# EAGLE design water-pump (EAGLE 8.7.1)
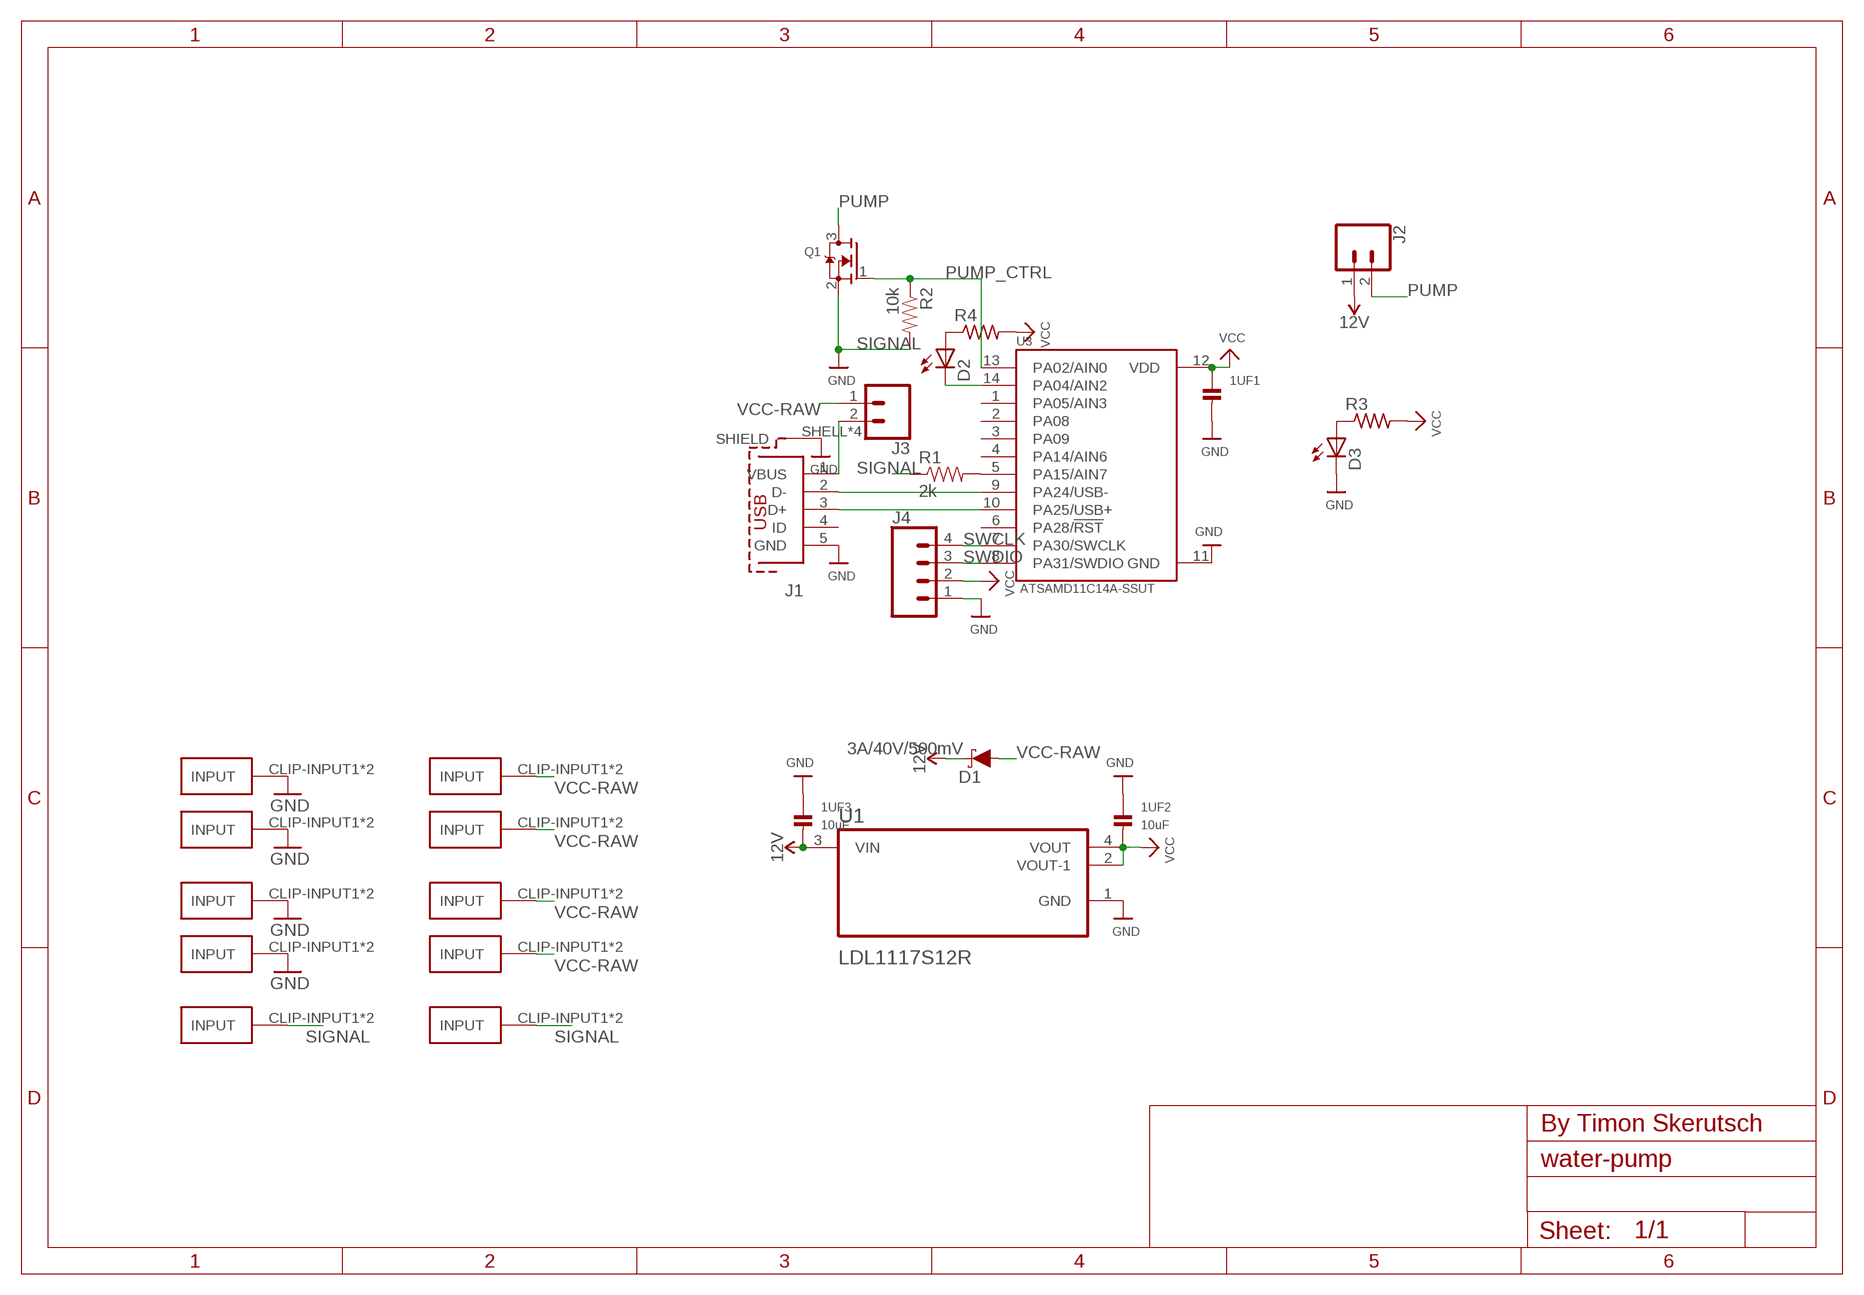
[diagram p0: schematic, sheet 1]

## Parts
1UF1  CAP_CERAMIC0603  [0603]
1UF2  10uF  CAP_CERAMIC0805  [0805]
1UF3  10uF  CAP_CERAMIC0805  [0805]
D1  3A/40V/500mV  DIODE-SCHOTTKY-B340A  [SMA-DIODE]
D2  LEDCHIPLED_0805  [CHIPLED_0805]
D3  LEDCHIPLED_0805  [CHIPLED_0805]
GND-CLIP  FUSE-HOLDER-5X20MM  [FUSE-HOLDER-5X20MM]
GND-CLIP1  FUSE-HOLDER-5X20MM  [FUSE-HOLDER-5X20MM]
GND-CLIP2  FUSE-HOLDER-5X20MM  [FUSE-HOLDER-5X20MM]
GND-CLIP3  FUSE-HOLDER-5X20MM  [FUSE-HOLDER-5X20MM]
J1  629105136821  [629105136821]
J2  CONN_02PTH3  [1X02_LONGPADS]
J3  CONN_02PTH3  [1X02_LONGPADS]
J4  CONN_04  [1X04]
PWM-CLIP  FUSE-HOLDER-5X20MM  [FUSE-HOLDER-5X20MM]
PWM-CLIP1  FUSE-HOLDER-5X20MM  [FUSE-HOLDER-5X20MM]
Q1  MOSFET-NWIDE  [SOT23-WIDE]
R1  2k  RESISTOR1206  [1206]
R2  10k  RESISTOR1206  [1206]
R3  R-US_R0805  [R0805]
R4  R-US_R0805  [R0805]
U1  LDL1117S12R  [SOT230P700X180-4N]
U3  ATSAMD11C14A-SSUT  [SOIC127P600X160-14N]
VCC-CLIP  FUSE-HOLDER-5X20MM  [FUSE-HOLDER-5X20MM]
VCC-CLIP1  FUSE-HOLDER-5X20MM  [FUSE-HOLDER-5X20MM]
VCC-CLIP2  FUSE-HOLDER-5X20MM  [FUSE-HOLDER-5X20MM]
VCC-CLIP3  FUSE-HOLDER-5X20MM  [FUSE-HOLDER-5X20MM]

## Nets
12V [VCC]: 1UF3.2 D1.C J2.1 U1.3(VIN)
GND: 1UF1.2 1UF2.1 1UF3.1 D3.C GND-CLIP1.CLIP-INPUT1(INPUT) GND-CLIP1.CLIP-INPUT2(INPUT) GND-CLIP2.CLIP-INPUT1(INPUT) GND-CLIP2.CLIP-INPUT2(INPUT) GND-CLIP3.CLIP-INPUT1(INPUT) GND-CLIP3.CLIP-INPUT2(INPUT) GND-CLIP.CLIP-INPUT1(INPUT) GND-CLIP.CLIP-INPUT2(INPUT) J1.5(GND) J1.SHELL1(SHIELD) J1.SHELL2(SHIELD) J1.SHELL3(SHIELD) J1.SHELL(SHIELD) J4.1 Q1.2(S) R2.2 U1.1(GND) U3.11(GND)
N$1: D3.A R3.1
N$3: R1.2 U3.5(PA15/AIN7)
N$4: J1.3(D+) U3.10(PA25/USB+)
N$5: J1.2(D-) U3.9(PA24/USB-)
N$6: J1.1(VBUS) J3.2
N$7: D2.A R4.1
N$8: D2.C U3.14(PA04/AIN2)
PUMP: J2.2 Q1.3(D)
PUMP_CTRL: Q1.1(G) R2.1 U3.13(PA02/AIN0)
SIGNAL: PWM-CLIP1.CLIP-INPUT1(INPUT) PWM-CLIP1.CLIP-INPUT2(INPUT) PWM-CLIP.CLIP-INPUT1(INPUT) PWM-CLIP.CLIP-INPUT2(INPUT) R1.1
SWCLK: J4.4 U3.7(PA30/SWCLK)
SWDIO: J4.3 U3.8(PA31/SWDIO)
VCC [VCC]: 1UF1.1 1UF2.2 J4.2 R3.2 R4.2 U1.2(VOUT-1) U1.4(VOUT) U3.12(VDD)
VCC-RAW [VCC]: D1.A J3.1 VCC-CLIP1.CLIP-INPUT1(INPUT) VCC-CLIP1.CLIP-INPUT2(INPUT) VCC-CLIP2.CLIP-INPUT1(INPUT) VCC-CLIP2.CLIP-INPUT2(INPUT) VCC-CLIP3.CLIP-INPUT1(INPUT) VCC-CLIP3.CLIP-INPUT2(INPUT) VCC-CLIP.CLIP-INPUT1(INPUT) VCC-CLIP.CLIP-INPUT2(INPUT)
Unconnected: J1.4(ID) U3.1(PA05/AIN3) U3.2(PA08) U3.3(PA09) U3.4(PA14/AIN6) U3.6(PA28/!RST)

## Notes on the sheet
- By Timon Skerutsch

## Library data of the parts
1UF1-1UF3 = microbuilder:CAP_CERAMIC: Ceramic Capacitors 0402 - 0402 Surface Mount Capacitors 16pF 50V 5% [Digikey: 445-4899-2-ND] 18pF 50V 5% [Digikey: 490-1281-2-ND] 22pF 50V 5% [Digikey: 490-1283-2-ND] 68pF 50V 5% [Digikey: 490-1289-2-ND] 0.1uF 10V 10% [Digikey: 490-1318-2-ND] 1.0uF 6.3V 10% [Digikey: 490-1320-2-ND] 0603 - 0603 Surface Mount Capacitors 16 pF 50V 5% [Digikey: 445-5051-2-ND] 22 pF 50V [Digikey: PCC220ACVTR-ND] 33 pF 50V 5% [Digikey: 490-1415-1-ND] 56pF 50V 5% [Digikey: 490-1421-1-ND] 220pF 50V 5% [Digikey: 445-1285-1-ND] 680 pF 50V 2200 pF 50V 5% C0G [Digikey: 445-1297-1-ND] 5600 pF 100V 5% X7R [Digikey: 478-3711-1-ND] 0.1 µF 25V 10% [Digikey: PCC2277TR-ND] 0.22 µF 16V 10% X7R [Digikey: 445-1318-1-ND] 1.0 µF 25V 10% [Digikey: 445-5146-2-ND] 0603 - RF Specific 3pF 250V +/-0.1pF RF [Digikey: 712-1347-1-ND] 18 pF 250V 5% [Digikey: 478-3505-1-ND or 712-1322-1-ND] 56 pF 250V 5% C0G RF [Digikey: 490-4867-1-ND] 68 pF 250V RF [Digikey: 490-4868-1-ND] 0805 - 0805 Surface Mount Capacitors 220 pF 250V 2% RF Ceramic Capacitor [Digikey: 712-1398-1-ND] 1000 pF 50V 2% NP0 Ceramic Capacitor [Digikey: 478-3760-1-ND] 0.1 µF 25V 10% Ceramic Capacitor [Digikey: PCC1828TR-ND] 1.0 µF 16V 10% Ceramic Capacitor[Digikey: 490-1691-2-ND] 10.0 µF 10V 10% Ceramic Capacitor[Digikey: 709-1228-1-ND] 10.0 uF 16V 10% Ceramic Capacitor [Digikey: 478-5165-2-ND] 47 uF 6.3V 20% Ceramic Capacitor [Digikey: 587-1779-1-ND or 399-5506-1-ND] 1206 - 1206 Surface Mount Capacitors 47uF 10V 20% Ceramic Capacitor [Digikey: 490-5528-1-ND or 399-5508-1-ND or 445-6010-1-ND] 100uF 6.3V -20%, +80% Y5V Ceramic Capacitor (Digikey: 490-4512-1-ND, Mouser: 81-GRM31CF50J107ZE1L)
D1 = SparkFun-DiscreteSemi:DIODE-SCHOTTKY: Schottky diode A Schottky diode is a semiconductor diode which has a low forward voltage drop and a very fast switching action.; PROD_ID: DIO-09886
D2 D3 = Adafruit:LED: LED OSRAM: - CHIPLED LG R971, LG N971, LY N971, LG Q971, LY Q971, LO R971, LY R971 LH N974, LH R974 LS Q976, LO Q976, LY Q976 LO Q996 - Hyper CHIPLED LW Q18S LB Q993, LB Q99A, LB R99A - SideLED LS A670, LO A670, LY A670, LG A670, LP A670 LB A673, LV A673, LT A673, LW A673 LH A674 LY A675 LS A676, LA A676, LO A676, LY A676, LW A676 LS A679, LY A679, LG A679 - Hyper Micro SIDELED® LS Y876, LA Y876, LO Y876, LY Y876 LT Y87S - SmartLED LW L88C, LW L88S LB L89C, LB L89S, LG L890 LS L89K, LO L89K, LY L89K LS L896, LA L896, LO L896, LY L896 - TOPLED LS T670, LO T670, LY T670, LG T670, LP T670 LSG T670, LSP T670, LSY T670, LOP T670, LYG T670 LG T671, LOG T671, LSG T671 LB T673, LV T673, LT T673, LW T673 LH T674 LS T676, LA T676, LO T676, LY T676, LB T676, LH T676, LSB T676, LW T676 LB T67C, LV T67C, LT T67C, LS T67K, LO T67K, LY T67K, LW E67C LS E67B, LA E67B, LO E67B, LY E67B, LB E67C, LV E67C, LT E67C LW T67C LS T679, LY T679, LG T679 LS T770, LO T770, LY T770, LG T770, LP T770 LB T773, LV T773, LT T773, LW T773 LH T774 LS E675, LA E675, LY E675, LS T675 LS T776, LA T776, LO T776, LY T776, LB T776 LHGB T686 LT T68C, LB T68C - Hyper Mini TOPLED® LB M676 - Mini TOPLED Santana® LG M470 LS M47K, LO M47K, LY M47K Source: http://www.osram.convergy.de/
GND-CLIP GND-CLIP1-GND-CLIP3 PWM-CLIP PWM-CLIP1 VCC-CLIP VCC-CLIP1-VCC-CLIP3 = timon-diverses:FUSE-HOLDER-5X20MM
J1 = EAGLE-INPUT_OUTPUT_CONNECTORS-rev17a:629105136821: WR-COM SMT Horizontal 5 Contacts Micro USB Type B,5 pins=>Code : Con_I-O_COM_MicroUSB_629105136821 <http://katalog.we-online.de/media/images/eican/Con_I-O_COM_MicroUSB_629105136821_pf2.jpg> Details see: http://katalog.we-online.de/en/em/COM_MICRO_SMT_TYPE_B_HORIZONTAL/629105136821?m Created 2014-07-09, Karrer Zheng 2014 (C) Würth Elektronik
J2 J3 = SparkFun-Connectors:CONN_02: Multi connection point. Often used as Generic Header-pin footprint for 0.1 inch spaced/style header connections On any of the 0.1 inch spaced packages, you can populate with these: Break Away Headers - Straight <https://www.sparkfun.com/products/116> (PRT-00116) Break Away Male Headers - Right Angle <https://www.sparkfun.com/products/553> (PRT-00553) Female Headers <https://www.sparkfun.com/products/115> (PRT-00115) Break Away Headers - Machine Pin <https://www.sparkfun.com/products/117> (PRT-00117) Break Away Female Headers - Swiss Machine Pin <https://www.sparkfun.com/products/743> (PRT-00743) For SCREWTERMINALS and SPRING TERMINALS visit here: Screw Terimnals on SparkFun.com <https://www.sparkfun.com/search/results?term=Screw+Terminals> (5mm/3.5mm/2.54mm spacing) This device is also useful as a general connection point to wire up your design to another part of your project. Our various solder wires solder well into these plated through hole pads. Hook-Up Wire - Assortment (Stranded, 22 AWG) <https://www.sparkfun.com/products/11375> (PRT-11375) Hook-Up Wire - Assortment (Solid Core, 22 AWG) <https://www.sparkfun.com/products/11367> (PRT-11367) View the entire wire category on our website here <https://www.sparkfun.com/categories/141> Special notes: Molex polarized connector foot print use with: PRT-08233 with associated crimp pins and housings. 2.54_SCREWTERM for use with PRT-10571. 3.5mm Screw Terminal footprints for PRT-08084 5mm Screw Terminal footprints for use with PRT-08432
J4 = SparkFun-Connectors:CONN_04: Multi connection point. Often used as Generic Header-pin footprint for 0.1 inch spaced/style header connections On any of the 0.1 inch spaced packages, you can populate with these: Break Away Headers - Straight <https://www.sparkfun.com/products/116> (PRT-00116) Break Away Male Headers - Right Angle <https://www.sparkfun.com/products/553> (PRT-00553) Female Headers <https://www.sparkfun.com/products/115> (PRT-00115) Break Away Headers - Machine Pin <https://www.sparkfun.com/products/117> (PRT-00117) Break Away Female Headers - Swiss Machine Pin <https://www.sparkfun.com/products/743> (PRT-00743) For SCREWTERMINALS and SPRING TERMINALS visit here: Screw Terimnals on SparkFun.com <https://www.sparkfun.com/search/results?term=Screw+Terminals> (5mm/3.5mm/2.54mm spacing) This device is also useful as a general connection point to wire up your design to another part of your project. Our various solder wires solder well into these plated through hole pads. Hook-Up Wire - Assortment (Stranded, 22 AWG) <https://www.sparkfun.com/products/11375> (PRT-11375) Hook-Up Wire - Assortment (Solid Core, 22 AWG) <https://www.sparkfun.com/products/11367> (PRT-11367) View the entire wire category on our website here <https://www.sparkfun.com/categories/141> Special notes: Molex polarized connector foot print use with SKU : PRT-08231 with associated crimp pins and housings. 1MM SMD Version SKU: PRT-10208; PROD_ID: CONN-09696
Q1 = microbuilder:MOSFET-N: N-Channel Mosfet LEGEND VDS: Voltage Drain-Source ID: Drain Current RDS(ON): Drain-Source On-State Resistance VGS(TH): Gate-Source Threshold Voltage CISS: Drain-Source Input Capacitance SOT-23 Name VDS ID RDS(ON) VGS(TH) CISS Order Number 2N7002E 60V 260mA 2.5 Ohm 2.5V @ 250uA 26.7pF @ 25V 2N7002ET1GOSTR-ND BSH103 30V 850mA 400 mOhm 400mV @ 1mA 83pF @ 24V BSH103,235-ND BSS138 60V 320mA 1.6 Ohm 1.5V @ 250uA 50pF @ 10V Mouser: 771-BSS138PW115 DMN2075U-7 20V 4.2A 38 mOhm 1V @ 250 uA 594.3pF @ 10V DMN2075U-7DICT-ND * BSS138 good choice for I2C level-shifting
R1 R2 = SparkFun-Resistors:RESISTOR: Resistor Basic schematic elements and footprints for 0603, 1206, and PTH resistors.
R3 R4 = Adafruit:R-US_: RESISTOR, American symbol
U1 = LDL1117S12R:LDL1117S12R: None; AVAILABILITY: Good; DESCRIPTION: 1.2 A High PSRR low dropout linear voltage regulator; MF: STMicroelectronics; MP: LDL1117S12R; PACKAGE: SOT-223 STMicroelectronics; PRICE: 0.22 USD
U3 = ATSAMD11C14A-SSUT:ATSAMD11C14A-SSUT: MCU 32-Bit SAM D11 ARM Cortex M0+ RISC 16KB Flash 1.8V/2.5V/3.3V 14-Pin SOIC T/R; AVAILABILITY: Good; DESCRIPTION: Cortex-M0+, 16KB FLASH, 4KB SRAM, USB - 14 SOIC, INDUSTRIAL, GREEN, 1.6-3.6V, 48MHz/ SOIC .150 (SS); MF: Microchip; MP: ATSAMD11C14A-SSUT; PACKAGE: SOIC-14 Microchip; PRICE: 1.18 USD

## Net classes
1 VCC: clearance 0.508 mm

## Board
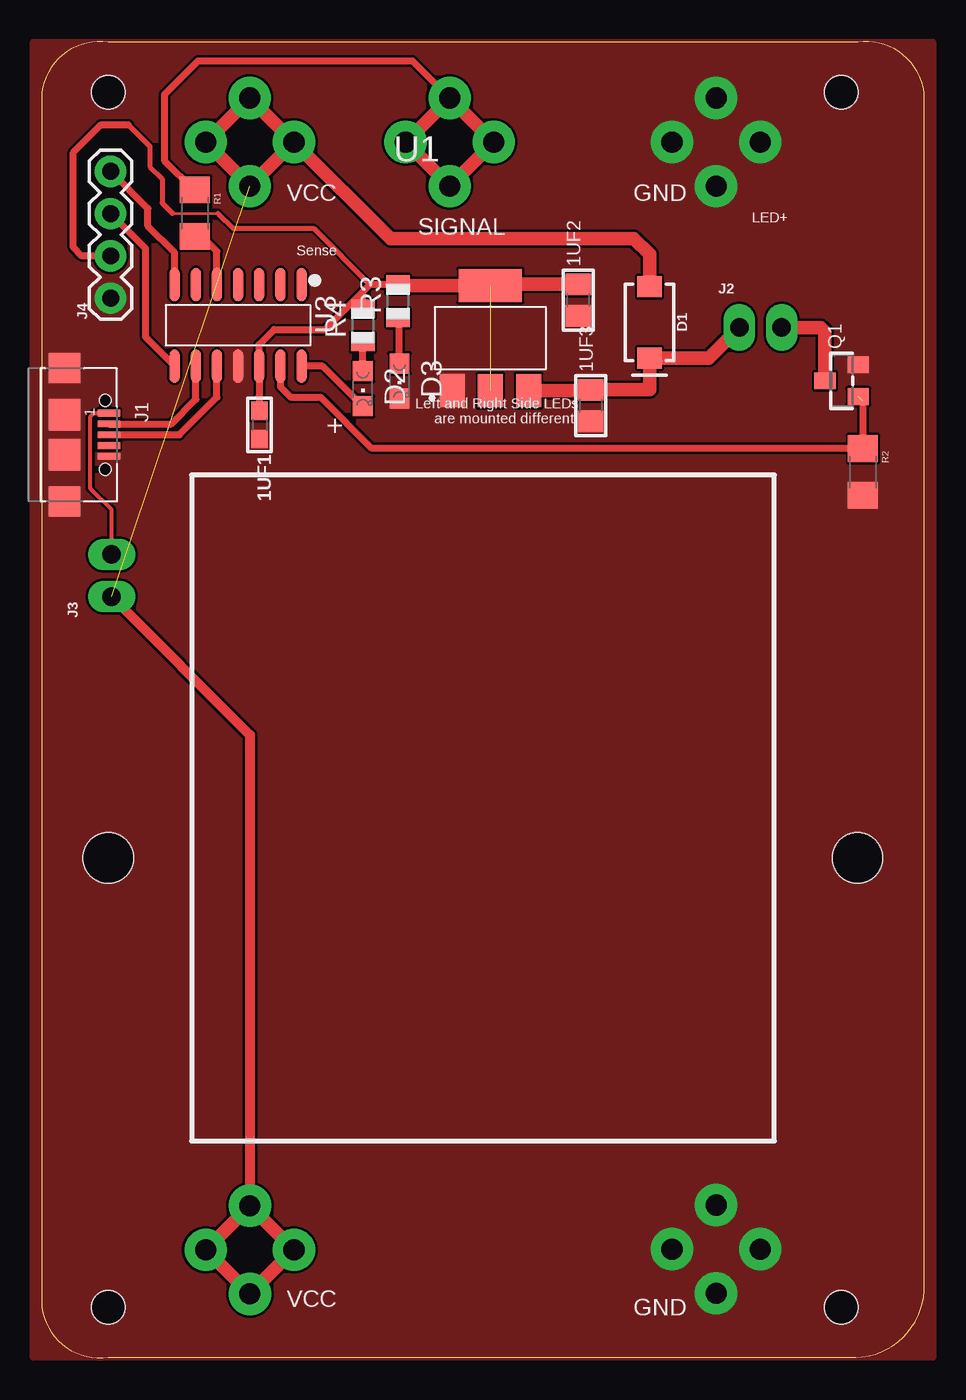
[diagram p1: board, top side]

Size 53 x 79.06 mm. Coordinates in mm from the lower left corner, seen from the top.
Outline: 48.5,0.03 arc90 53,4.03 53,76.03 arc90 49,79.03 4,79.03 arc90 0,76.03 0,3.03 arc90 4,0.03 48.5,0.03
Copper layers (1*16): Top 0.035mm / dielectric 1.5mm / Bottom 0.035mm
Design rules "OthermillDRC_30_deg_v2": minimum track width 6mil, minimum drill 0.8mm, track to track 6mil, track to pad 6mil, pad to pad 6mil, via to via 6mil, smd to smd 0mil, copper to edge 0mil, drill to drill 6mil, minimum pad ring 10mil, minimum via ring 10mil, stop-mask expansion 1mil, vias tented up to drill 30mil, thermal gap 6mil
Holes 2 mm at 4,76.03 48,76.03 4,3.03 48,3.03
Holes 3 mm at 49,30.03 4,30.03

### Footprints (pad centres in the part's own frame; a part is rotated, then mirrored left to right if it is on the bottom)
0603 = smd 1.1 x 1: 1 -0.85,0; 2 0.85,0
0805 = smd 1.3 x 1.5: 1 -0.95,0; 2 0.95,0
SMA-DIODE = smd 1.27 x 1.47: A -2.15,0; C 2.15,0
CHIPLED_0805 = smd 1.2 x 1.2: A 0,-1.05; C 0,1.05
FUSE-HOLDER-5X20MM = drill 1.27 pad 2.54: CLIP-INPUT1 -2.65,0; CLIP-INPUT2 2.65,0
629105136821 = smd 0.4 x 1.35: 1 -1.3,2.675; 2 -0.65,2.675; 3 0,2.675; 4 0.65,2.675; 5 1.3,2.675 | smd 1.8 x 1.9: SHELL -4,0; SHELL3 4,0 | smd 1.9 x 1.9: SHELL1 -1.2,0; SHELL2 1.2,0 | hole 0.7: -2.075,2.45; 2.075,2.45
1X02_LONGPADS = drill 1.118 pad 1.88 long: 1 0,0; 2 2.54,0
1X04 = drill 1.016 pad 1.88: 1 0,0; 2 2.54,0; 3 5.08,0; 4 7.62,0
SOT23-WIDE = smd 1 x 1.27: 1 -0.95,-1; 2 0.95,-1; 3 0,1
1206 = smd 1.6 x 1.8: 1 -1.4,0; 2 1.4,0
R0805 = smd 1.1 x 1.4: 1 -1,0; 2 1,0
SOT230P700X180-4N = smd 1.5 x 2: 1 -2.3,-3.15; 2 0,-3.15; 3 2.3,-3.15 | smd 3.8 x 2: 4 0,3.15
SOIC127P600X160-14N = smd 2 x 0.6: 1 -2.45,3.81; 2 -2.45,2.54; 3 -2.45,1.27; 4 -2.45,0; 5 -2.45,-1.27; 6 -2.45,-2.54; 7 -2.45,-3.81; 8 2.45,-3.81; 9 2.45,-2.54; 10 2.45,-1.27; 11 2.45,0; 12 2.45,1.27; 13 2.45,2.54; 14 2.45,3.81

### Placement (x,y rotation side)
1UF1  13.08,56.04 270 top
1UF2  32.22,63.54 90 top
1UF3  32.97,57.2 90 top
D1  36.5,62.2 270 top
D2  19.29,58.21 180 top
D3  21.49,58.68 180 top
GND-CLIP  40.5,73.03 0 bottom
GND-CLIP1  40.5,6.53 90 bottom
GND-CLIP2  40.5,6.53 0 bottom
GND-CLIP3  40.5,73.03 90 bottom
J1  1.37,55.45 270 top
J2  41.89,61.89 0 top
J3  4.21,45.73 90 top
J4  4.14,63.65 90 top
PWM-CLIP  24.5,73.03 0 bottom
PWM-CLIP1  24.5,73.03 90 bottom
Q1  48.03,58.69 90 top
R1  9.21,68.76 270 top
R2  49.32,53.22 270 top
R3  21.39,63.47 90 top
R4  19.29,62.02 90 top
U1  26.94,61.25 0 top
U3  11.79,62.02 270 top
VCC-CLIP  12.5,73.03 0 bottom
VCC-CLIP1  12.5,6.49 90 bottom
VCC-CLIP2  12.5,6.49 0 bottom
VCC-CLIP3  12.5,73.03 270 bottom

### Tracks (layer width: path | path; a pad name or v marks a point on that pad's centre or on a via)
12V
  Top 0.813: U1.3 31.88,58.1 1UF3.2 36.52,58.15 D1.C 40.05,60.05 J2.1
GND
  pour Top (rank 2, no thermals): -0.5,79.03 53.5,79.03 53.5,0.03 -0.5,0.03
N$1
  Top 0.406: D3.A 21.49,62.38 R3.1
N$3
  Top 0.406: U3.5 10.53,66.47 9.38,67.61 R1.2
N$4
  Top 0.406: J1.3 8.27,55.45 10.53,57.7 U3.10
N$5
  Top 0.406: J1.2 7.78,56.1 9.26,57.58 U3.9
N$6
  Top 0.254: J3.2 4.21,50.94 2.92,52.23 2.92,56.55 3.12,56.75 J1.1
N$7
  Top 0.406: D2.A R4.1
N$8
  Top 0.406: D2.C 16.88,59.57 U3.14
PUMP
  Top 0.813: J2.2 46.78,61.89 47.03,61.64 Q1.3
PUMP_CTRL  (1 unrouted)
  Top 0.406: 49.32,57.46 49.32,54.66 | 49.32,54.66 R2.1 | U3.13 14.34,58.34 14.97,57.7 16.75,57.7 19.8,54.66 49.32,54.66
SIGNAL
  Top 0.406: PWM-CLIP1.CLIP-INPUT2 22.28,77.9 9.38,77.9 7.37,75.88 7.37,71.91 9.12,70.16 R1.1
  Top 0.813: PWM-CLIP.CLIP-INPUT1 | PWM-CLIP.CLIP-INPUT1 PWM-CLIP1.CLIP-INPUT2 PWM-CLIP.CLIP-INPUT2 PWM-CLIP1.CLIP-INPUT1 PWM-CLIP.CLIP-INPUT1
SWCLK
  Top 0.406: U3.7 7.99,66.38 6.38,67.99 6.38,69.04 J4.4
SWDIO
  Top 0.406: J4.3 6.22,66.65 6.22,61.33 U3.8
VCC  (1 unrouted)
  Top 0.152: 7.87,68.74 10.6,68.74
  Top 0.305: 5.21,74.07 6.5,72.78 6.5,71.56 7.24,70.82 7.24,69.37 7.87,68.74 | 10.6,68.74 11.5,67.85 16.33,67.85 19.71,64.47
  Top 0.406: 21.11,64.47 R3.2 19.71,64.47 19.29,64.05 | 19.29,64.05 17,61.77 13.95,61.77 13.06,60.88 U3.12 13.06,57.77 1UF1.1 | R4.2 19.29,64.05 | J4.2 2.42,66.19 1.91,66.71 1.91,72.42 3.56,74.07 5.21,74.07
  Top 0.813: 1UF2.2 27.02,64.49 U1.4 21.46,64.4 R3.2 21.35,64.51
VCC-RAW  (1 unrouted)
  Top 0.61: J3.1 12.5,37.43 VCC-CLIP1.CLIP-INPUT2
  Top 0.813: D1.A 36.5,66.29 35.56,67.23 20.95,67.23 VCC-CLIP.CLIP-INPUT1 | VCC-CLIP.CLIP-INPUT1 VCC-CLIP3.CLIP-INPUT2 VCC-CLIP.CLIP-INPUT2 VCC-CLIP3.CLIP-INPUT1 VCC-CLIP.CLIP-INPUT1 | VCC-CLIP2.CLIP-INPUT2 VCC-CLIP1.CLIP-INPUT1 VCC-CLIP2.CLIP-INPUT1 VCC-CLIP1.CLIP-INPUT2 VCC-CLIP2.CLIP-INPUT2

### Text on the board
tPlace: Sense | Left and Right Side LEDs / are mounted different! | +
tNames: VCC | GND | LED+ | SIGNAL | VCC | GND
Measures: PUMP